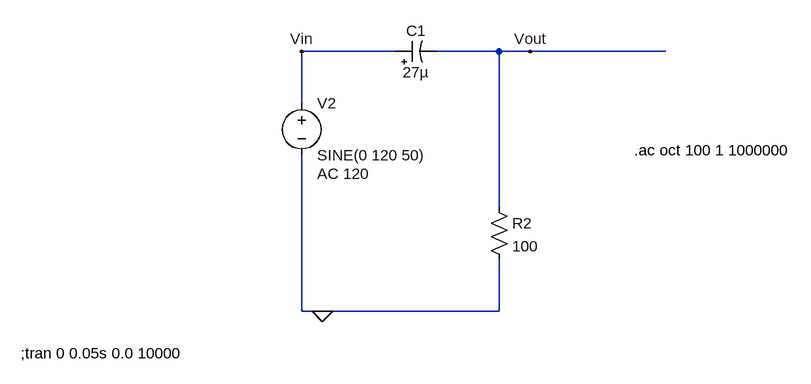
[diagram p0: schematic High_pass_filter_Electrisense.asc]
High_pass_filter_Electrisense.asc, the LTspice schematic file:
Version 4
SHEET 1 880 680
WIRE 112 -112 -32 -112
WIRE 272 -112 176 -112
WIRE 320 -112 272 -112
WIRE 528 -112 320 -112
WIRE -32 -32 -32 -112
WIRE 272 128 272 -112
WIRE -32 288 -32 48
WIRE 0 288 -32 288
WIRE 272 288 272 208
WIRE 272 288 0 288
FLAG -32 -112 Vin
FLAG 320 -112 Vout
FLAG 0 288 0
SYMBOL polcap 112 -96 R270
WINDOW 0 32 32 VTop 2
WINDOW 3 0 32 VBottom 2
SYMATTR InstName C1
SYMATTR Value 27µ
SYMATTR SpiceLine V=25 Irms=120m Rser=1 Lser=0 mfg="Panasonic" pn="ECA1EFQ270" type="Al electrolytic"
SYMATTR Description Capacitor
SYMATTR Type cap
SYMBOL res 256 112 R0
SYMATTR InstName R2
SYMATTR Value 100
SYMATTR SpiceLine tol=1 pwr=0.1
SYMBOL voltage -32 -48 R0
WINDOW 123 24 124 Left 2
WINDOW 39 0 0 Left 2
SYMATTR InstName V2
SYMATTR Value SINE(0 120 50)
SYMATTR Value2 AC 120
TEXT -464 352 Left 2 !;tran 0 0.05s 0.0 10000
TEXT 480 40 Left 2 !.ac oct 100 1 1000000

The netlist it stands for:
* High_pass_filter_Electrisense.asc
C1 Vin Vout 27µ V=25 Irms=120m Rser=1 Lser=0 mfg="Panasonic" pn="ECA1EFQ270" type="Al electrolytic"
R2 Vout 0 100 tol=1 pwr=0.1
V2 Vin 0 SINE(0 120 50) AC 120
;tran 0 0.05s 0.0 10000
.ac oct 100 1 1000000
.backanno
.end

* Results of the author's LTspice run, read from the files saved beside the schematic
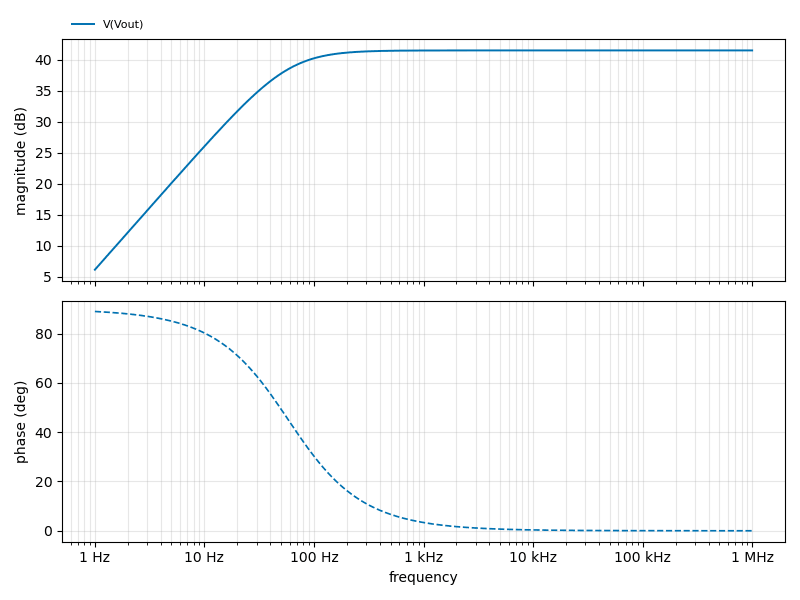
[diagram p1: AC Analysis of High_pass_filter_Electrisense.asc, plotted from the saved traces]
* AC Analysis, 1 run:
*   V(Vout): 6.17 dB at 1 Hz, 41.50 dB at 1 MHz, peak 41.50 dB at 1 MHz, 3 dB below the peak at 58.36 Hz